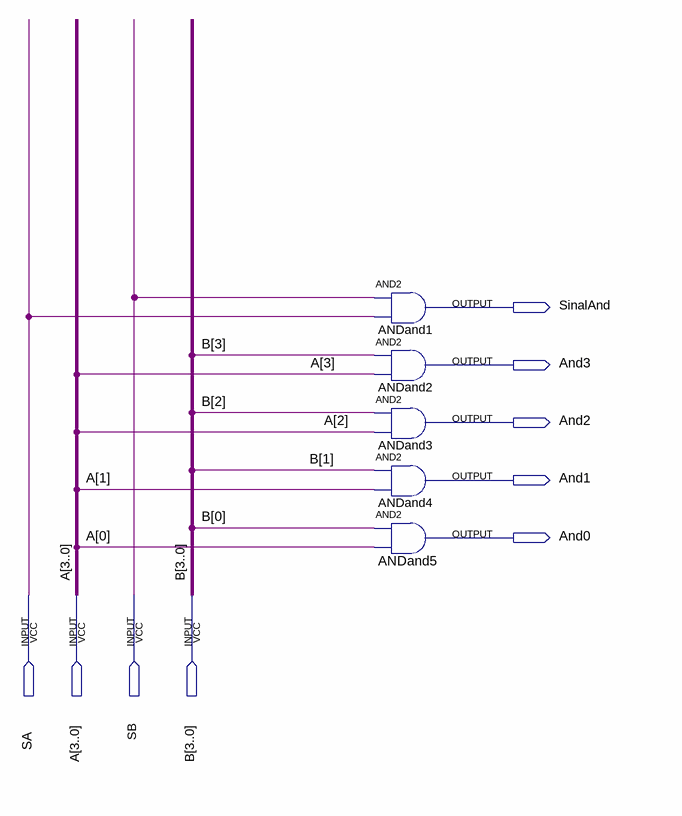
[diagram p0: schematic sheet]
// Quartus schematic CircuitoAnd.bdf as structural Verilog: 5 symbols, 9 pins
module CircuitoAnd (
  input  SA,
  input  [3:0] A,
  input  SB,
  input  [3:0] B,
  output SinalAnd,
  output And3,
  output And2,
  output And1,
  output And0
);

  and ANDand1 (SinalAnd, SB, SA);
  and ANDand2 (And3, B[3], A[3]);
  and ANDand3 (And2, B[2], A[2]);
  and ANDand4 (And1, B[1], A[1]);
  and ANDand5 (And0, B[0], A[0]);
endmodule
